# Altium project Sayma_AMC.PrjPcb (part 7 of 18)

## Sheet PWR_0V9_20A.SchDoc: Sayma AMC
size 420 x 297 mm; $$Internal___BlkDate: 0:12:25_2-9-18; $$Internal_NAME_PLACEHOLDER: a3sheet; $$Internal_Resolution: 00001mm; $$NotCommonProperty_@NAME: PWR_0V9_20A; $$NotCommonProperty_@PRINTORDER: 3; $$NotCommonProperty_@SHEET: 1; $$NotCommonProperty_@SHEETTOTAL: 1; CmpIndex: 76; Drawing Author: G.Kasprowicz; Drawing Number: Sayma AMC; Drawing Project: AMC FMC Carrier Board; Drawing Revision: 2.0; SymIndex: 2141; CheckedBy: P.Kulik,T.Przywozki,W.Ruclo; Author: G.Kasprowicz; CompanyName: WUT ISE; DrawnBy: G.Kasprowicz; Organization: WUT ISE; Address1: PW ISE; Address2: Nowowiejska 15/19 00-665 Warsaw; Address3: gkasprow@gmail.com; DocumentNumber: 13; Revision: 2; SheetNumber: 13; SheetTotal: 32; ModifiedBy: -; CheckedDate: -; Title2: VCCINT 0.95V; DivGrp: WUT ISE; Designer: G.Kasprowicz; ModifiedDate: -; ProjectName: Sensor Box
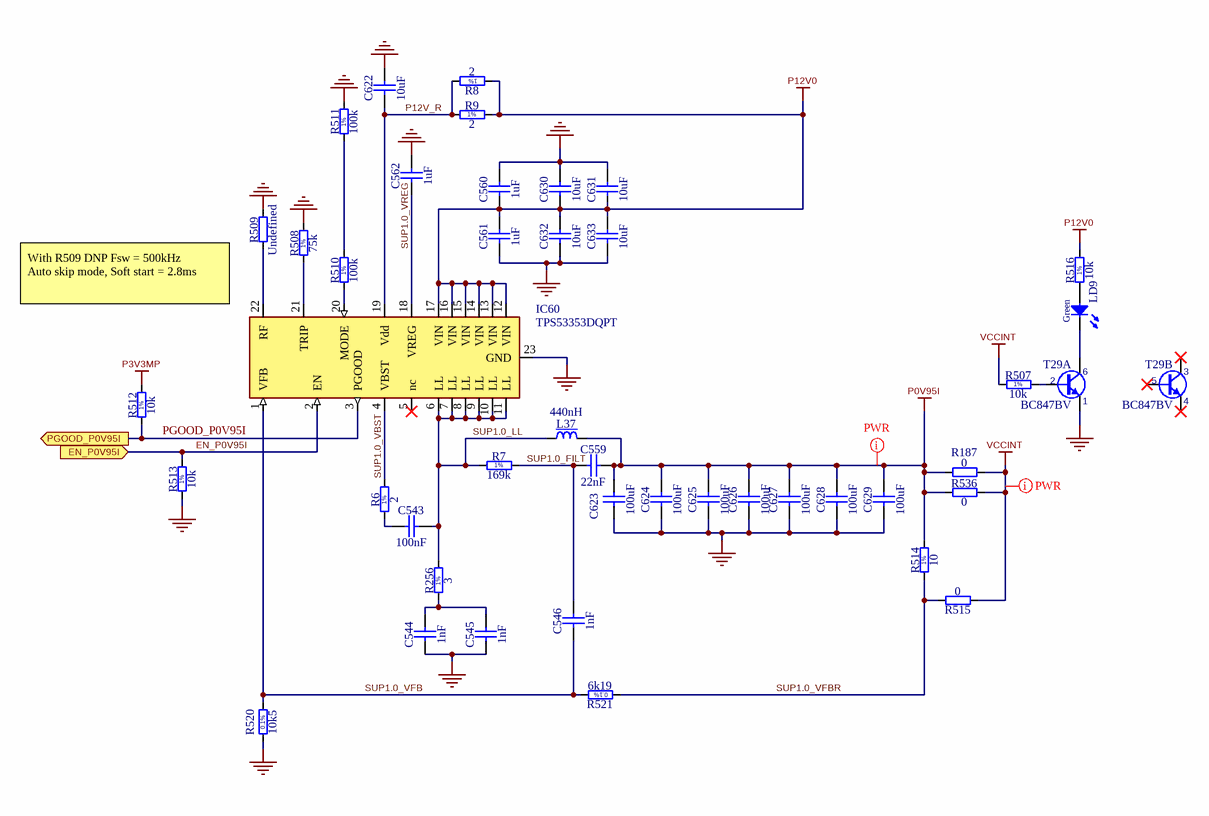
[diagram p10: PWR_0V9_20A.SchDoc]

### Parts
C543  100nF  [CAPC1005X55N]
C544  1nF  [CAPC1005X55N]
C545  1nF  [CAPC1005X55N]
C546  1nF  [CAPC1005X55N]
C559  22nF  [CAPC1608X87N]
C560  1uF  [CAPC1608X87N]
C561  1uF  [CAPC1608X87N]
C562  1uF  [CAPC1608X87N]
C622  10uF  [CAPC3216X180N]
C623  100uF  [CAPC3216X180N]
C624  100uF  [CAPC3216X180N]
C625  100uF  [CAPC3216X180N]
C626  100uF  [CAPC3216X180N]
C627  100uF  [CAPC3216X180N]
C628  100uF  [CAPC3216X180N]
C629  100uF  [CAPC3216X180N]
C630  10uF  [CAPC3216X180N]
C631  10uF  [CAPC3216X180N]
C632  10uF  [CAPC3216X180N]
C633  10uF  [CAPC3216X180N]
IC60  TPS53353DQPT  [LCCS50P600X500X150-22N]
L37  440nH  [IND_PULSE_PA0513]
LD9  Green  [LED_KINGBRIGHT_KPH-1608CGCK]
R6  2  [RESC1608X55N]
R7  169k  [RESC1608X55N]
R8  2  [RESC1608X55N]
R9  2  [RESC1608X55N]
R187  0  [RESC6331X70N]
R256  3  [RESC3216X65N]
R507  10k  [RESC1005X40N]
R508  75k  [RESC1005X40N]
R509  Undefined  [RESC1005X40N]
R510  100k  [RESC1005X40N]
R511  100k  [RESC1005X40N]
R512  10k  [RESC1005X40N]
R513  10k  [RESC1005X40N]
R514  10  [RESC1005X40N]
R515  0  [RESC1005X40N]
R516  10k  [RESC1005X40N]
R520  10k5  [RESC1608X55N]
R521  6k19  [RESC1608X55N]
R536  0  [RESC6331X70N]
T29  BC847BV  [SOTFL50P160X60-6N]  (parts A,B of 2)

### Ports
EN_P0V95I (in), PGOOD_P0V95I (out)

### Nets
GND: C544.1 C545.1 C560.2 C561.1 C562.2 C622.2 C623.1 C624.1 C625.1 C626.1 C627.1 C628.1 C629.1 C630.2 C631.2 C632.1 C633.1 IC60.23(GND) R508.2 R509.2 R511.2 R513.1 R520.1 T29.1(E)
P0V95I: C559.2 C623.2 C624.2 C625.2 C626.2 C627.2 C628.2 C629.2 L37.2 R187.1 R514.2 R536.1
P3V3MP: R512.2
P12V0: C560.1 C561.2 C630.1 C631.1 C632.2 C633.2 IC60.12(VIN) IC60.13(VIN) IC60.14(VIN) IC60.15(VIN) IC60.16(VIN) IC60.17(VIN) R8.2 R9.2 R516.2
VCCINT: R187.2 R507.1 R515.1 R536.2
EN_P0V95I: IC60.2(EN) R513.2 ; port EN_P0V95I  [project net EN_VCCINT]
P12V_R: C622.1 IC60.19(Vdd) R8.1 R9.1
PGOOD_P0V95I: IC60.3(PGOOD) R512.1 ; port PGOOD_P0V95I  [project net P0V95I_PG]
SUP1.0_FILT: C546.2 C559.1 R7.2
SUP1.0_LL: C543.2 IC60.6(LL) IC60.7(LL) IC60.8(LL) IC60.9(LL) IC60.10(LL) IC60.11(LL) L37.1 R7.1 R256.2
SUP1.0_VBST: IC60.4(VBST) R6.2
SUP1.0_VFB: C546.1 IC60.1(VFB) R520.2 R521.2
SUP1.0_VFBR: R514.1 R515.2 R521.1
SUP1.0_VREG: C562.1 IC60.18(VREG)
NetC543_1: C543.1 R6.1
NetC544_2: C544.2 C545.2 R256.1
NetIC60_20: IC60.20(MODE) R510.1
NetIC60_21: IC60.21(TRIP) R508.1
NetIC60_22: IC60.22(RF) R509.1
NetLD9_1: LD9.1(C) T29.6(C)
NetLD9_2: LD9.2(A) R516.1
NetR507_2: R507.2 T29.2(B)
NetR510_2: R510.2 R511.1

Not connected (* = marked no-connect by the designer): IC60 5(nc)*; T29 3(C)* 4(E)* 5(B)*

### Layout directives
net class PWR: P0V95I, VCCINT

### Notes on the sheet
- With R509 DNP Fsw = 500kHz
  Auto skip mode, Soft start = 2.8ms
- Project/Equipment
- Document
- Designer
- Drawn by
- Check.by
- Copyright WUT ISE 2018.
  This documentation describes Open Hardware and is licensed under the CERN OHL v.1.1. You may redistribute and modify this documentation under the terms of the CERN OHL v.1.1. (http://ohwr.org/CERNOHL). This documentation is distributed WITHOUT ANY EXPRESS OR IMPLIED WARRANTY, INCLUDING OF MERCHANTABILITY, SATISFACTORY QUALITY AND FITNESS FOR A PARTICULAR PURPOSE. Please see the CERN OHL v.1.1 for applicable conditions.
- Contact
- File
- Last Mod.
- Print Date
- Sheet
- Size
- A3
- of
- Rev
- (in symbol R0402_10K_1%_0.0625W_100PPM) 1%
- (in symbol R0402_10R_1%_0.0625W_200PPM) 1%
- (in symbol R0402_75K_1%_0.0625W_100PPM) 1%
- (in symbol R0402_100K_1%_0.0625W_100PPM) 1%
- (in symbol R0603_2R_1%_0.1W_200PPM) 1%
- (in symbol R0603_6K19_0.1%_0.063W_10PPM) 0.1%
- (in symbol R0603_10K5_0.1%_0.063W_10PPM) 0.1%
- (in symbol R0603_169K_1%_0.1W_100PPM) 1%
- (in symbol R1206_3R_1%_0.25W_200PPM) 1%

### Library data of the parts
C543 = CC0402_100NF_16V_10%_X5R: Non-polarised capacitor; Manufacturer: GENERIC; Part Description: SMD Multilayer Chip Ceramic Capacitor; Manufacturer1 Part Number: GRM155R61C104KA88D; Tolerance: ±10%; Voltage: 16V; TC: X5R; Manufacturer Part Number: CC0402_100NF_16V_10%_X5R; Part Number: CC0402_100NF_16V_10%_X5R; Value: 100nF; Component Kind: Standard; Component Type: Standard; Pin Count: 2; Status: None; Case: 0402; Mounted: Yes; Socket: No; SMD: Yes; Sense: No; Manufacturer1 Example: MURATA; Manufacturer1 ComponentHeight: 0.55mm; HelpURL: \\cern.ch\dfs\Applications\Altium\Datasheets\CC0402_X5R_MURATA_GRM.pdf; Author: CERN DEM JLC; CreateDate: 10.12.2013; LatestRevisionDate: 10.12.2013
C544-C546 = CC0402_1NF_50V_10%_X7R: Non-polarised capacitor; Manufacturer: GENERIC; Part Description: SMD Multilayer Chip Ceramic Capacitor; Manufacturer1 Part Number: 223858715623; Tolerance: ±10%; Voltage: 50V; TC: X7R; Manufacturer Part Number: CC0402_1NF_50V_10%_X7R; Part Number: CC0402_1NF_50V_10%_X7R; Value: 1nF; Component Kind: Standard; Component Type: Standard; Pin Count: 2; Status: Not Recommended; Case: 0402; Mounted: Yes; Socket: No; SMD: Yes; Sense: No; Manufacturer1 Example: PHYCOMP; Manufacturer1 ComponentHeight: 0.55mm; HelpURL: \\cern.ch\dfs\Applications\Altium\Datasheets\CC0402_X7R_PHYCOMP.pdf; Author: CERN DEM JLC; CreateDate: 03.12.2007; LatestRevisionDate: 03.12.2007
C559 = CC0603_22NF_50V_10%_X7R: Non-polarised capacitor; Manufacturer: GENERIC; Part Description: SMD Multilayer Chip Ceramic Capacitor; Manufacturer1 Part Number: 223858615641; Tolerance: ±10%; Voltage: 50V; TC: X7R; Manufacturer Part Number: CC0603_22NF_50V_10%_X7R; Part Number: CC0603_22NF_50V_10%_X7R; Value: 22nF; Component Kind: Standard; Component Type: Standard; Pin Count: 2; Status: Preferred; Case: 0603; Mounted: Yes; Socket: No; SMD: Yes; Sense: No; Manufacturer1 Example: PHYCOMP; Manufacturer1 ComponentHeight: 0.87mm; HelpURL: \\cern.ch\dfs\Applications\Altium\Datasheets\CC0603_X7R_PHYCOMP.pdf; Author: CERN DEM JLC; CreateDate: 03.12.2007; LatestRevisionDate: 03.12.2007
C560-C562 = CC0603_1UF_25V_10%_X7R: Non-polarised capacitor; Manufacturer: GENERIC; Part Description: SMD Multilayer Chip Ceramic Capacitor; Manufacturer1 Part Number: GRM188R71E105KA12D; Tolerance: ±10%; Voltage: 25V; TC: X7R; Manufacturer Part Number: CC0603_1UF_25V_10%_X7R; Part Number: CC0603_1UF_25V_10%_X7R; Value: 1uF; Component Kind: Standard; Component Type: Standard; Pin Count: 2; Status: None; Case: 0603; Mounted: Yes; Socket: No; SMD: Yes; Sense: No; Manufacturer1 Example: MURATA; Manufacturer1 ComponentHeight: 0.9mm; HelpURL: \\cern.ch\dfs\Applications\Altium\Datasheets\CC0603_X7R_MURATA.pdf; Author: CERN DEM JLC; CreateDate: 18.01.2011; LatestRevisionDate: 18.01.2011
C622 C630-C633 = CC1206_10uF_25V_10%_X7R: Non-polarised capacitor; Manufacturer: GENERIC; Part Description: SMD Multilayer Chip Ceramic Capacitor; Manufacturer1 Part Number: C1206C106K4RACTU; Tolerance: ±10%; Voltage: 25V; TC: X7R; Manufacturer Part Number: CC1206_10uF_25V_10%_X7R; Part Number: CC1206_10UF_25V_10%_X7R; Value: 10uF; Component Kind: Standard; Component Type: Standard; Pin Count: 2; Status: Preferred; Case: 1206; Mounted: Yes; Socket: No; SMD: Yes; Sense: No; Manufacturer1 Example: KEMET; Manufacturer1 ComponentHeight: 1.8mm; HelpURL: \\cern.ch\dfs\Applications\Altium\Datasheets\CC1206_X7R_KEMET.pdf; Author: CERN DEM JLC; CreateDate: 12.09.2012; LatestRevisionDate: 12.09.2012
C623-C629 = CC1206_100UF_6.3V_20%_X5R: Non-polarised capacitor; Manufacturer: GENERIC; Part Description: SMD Multilayer Chip Ceramic Capacitor; Manufacturer1 Part Number: C1206C107M9PACTU; Tolerance: ±10%; Voltage: 6.3V; TC: X5R; Manufacturer Part Number: CC1206_100UF_6.3V_20%_X5R; Part Number: CC1206_100UF_6.3V_20%_X5R; Value: 100uF; Component Kind: Standard; Component Type: Standard; Pin Count: 2; Status: None; Case: 1206; Mounted: Yes; Socket: No; SMD: Yes; Sense: No; Manufacturer1 Example: KEMET; Manufacturer1 ComponentHeight: 1.8mm; HelpURL: \\cern.ch\dfs\Applications\Altium\Datasheets\CC1206_X5R_KEMET.pdf; Author: CERN DEM JLC; CreateDate: 26.09.2012; LatestRevisionDate: 26.09.2012
IC60 = PM_TPS53353: High-Efficiency 20-A Synchronous Buck Converter with Eco-mode™; Supplier 1: Digi-Key; Supplier Part Number 1: 296-29490-1-ND; Manufacturer Part Number: TPS53353DQPT
L37 = IND_440NH_20%_PULSE_PA0513.441NLT: Inductor With Core; Manufacturer: PULSE ELECTRONICS; Part Description: SMT Power Inductor; Tolerance: ±20%; Power: 30A; Resistance: 0.0032R; Manufacturer Part Number: PA0513.441NLT; Part Number: IND_440NH_20%_PULSE_PA0513.441NLT; Value: 440nH; Component Kind: Standard; Component Type: Standard; Pin Count: 2; Status: None; Mounted: Yes; Socket: No; SMD: Yes; Sense: No; ComponentHeight: 8mm; HelpURL: \\cern.ch\dfs\Applications\Altium\Datasheets\IND_PULSE_PA0513.441NLT.pdf; Author: CERN DEM JLC; CreateDate: 15.11.2016; LatestRevisionDate: 15.11.2016
LD9 = LED_KINGBRIGHT_KPH-1608CGCK: LED Green 1C 2A; Part Description: SMD Green LED, Case 1.6mmX0.8mm(0603), 0.65mm Thickness; PressFit: No; Bonding: No; Manufacturer Part Number: KPH-1608CGCK; Manufacturer: KINGBRIGHT; PackageDescription: SMT Green LED, Case 0603, Body L 1.6 x W 0.8mm H 0.65mm; Part Number: LED_KINGBRIGHT_KPH-1608CGCK; Component Kind: Standard; Component Type: Standard; Color: Green; Pin Count: 2; Mounted: Yes; Socket: No; SMD: Yes; Sense: No; ComponentHeight: 0.65mm; HelpURL: \\cern.ch\dfs\Applications\Altium\Datasheets\LED_KINGBRIGHT_KPH-1608CGCK.pdf; Author: CERN DEM JLC; CreateDate: 03.07.2017; LatestRevisionDate: 03.07.2017
R6 R8 R9 = R0603_2R_1%_0.1W_200PPM: Resistor - 1%; Manufacturer: GENERIC; Part Description: General Purpose Thick Film Chip Resistor; Manufacturer1 Part Number: 232270462008L or RC0603FR-072RL; Power: 0.1W; TC: ±200ppm/°C; PressFit: No; Manufacturer Part Number: R0603_2R_1%_0.1W_200PPM; Part Number: R0603_2R_1%_0.1W_200PPM; Tolerance: ±1%; Value: 2; Component Kind: Standard; Component Type: Standard; Pin Count: 2; Status: Preferred; Case: 0603; Mounted: Yes; Sense: No; Socket: No; SMD: Yes; Manufacturer1 Example: YAGEO PHYCOMP; Manufacturer1 ComponentHeight: 0.65mm; HelpURL: \\cern.ch\dfs\Applications\Altium\Datasheets\R0603_Tyco_RN73.pdf; Author: CERN DEM JLC; CreateDate: 03.12.2007; LatestRevisionDate: 17.10.2012
R7 = R0603_169K_1%_0.1W_100PPM: Resistor - 1%; Manufacturer: GENERIC; Part Description: General Purpose Thick Film Chip Resistor; Manufacturer1 Part Number: CRCW0603169KFKEA; Power: 0.1W; TC: ±100ppm/°C; PressFit: No; Manufacturer Part Number: R0603_169K_1%_0.1W_100PPM; Part Number: R0603_169k_1%_0.1W_100PPM; Tolerance: ±1%; Value: 169k; Component Kind: Standard; Component Type: Standard; Pin Count: 2; Status: Preferred; Case: 0603; Mounted: Yes; Sense: No; Socket: No; SMD: Yes; Manufacturer1 Example: VISHAY; Manufacturer1 ComponentHeight: 0.50mm; HelpURL: \\cern.ch\dfs\Applications\Altium\Datasheets\R0603_VISHAY_CRCW e3.pdf; Author: CERN DEM JLC; CreateDate: 17.03.2014; LatestRevisionDate: 17.03.2014
R187 R536 = R2512_0R_JUMPER: Resistor; Manufacturer: GENERIC; Part Description: 16A (0.005R Max DC Resistance) Zero Ohm Jumper; Manufacturer1 Part Number: CRCW25120000Z0EG; PressFit: No; Manufacturer Part Number: R2512_0R_JUMPER; Part Number: R2512_0R_JUMPER; Value: 0; Component Kind: Standard; Component Type: Standard; Pin Count: 2; Status: Preferred; Case: 2512; Mounted: Yes; Sense: No; Socket: No; SMD: Yes; Manufacturer1 Example: VISHAY DRALORIC; Manufacturer1 ComponentHeight: 0.7mm; HelpURL: \\cern.ch\dfs\Applications\Altium\Datasheets\R2512_VISHAY_CRCW-HP E3.pdf; Author: CERN DEM JLC; CreateDate: 17.09.2014; LatestRevisionDate: 17.09.2014
R256 = R1206_3R_1%_0.25W_200PPM: Resistor - 1%; Manufacturer: GENERIC; Part Description: General Purpose Thick Film Chip Resistor; Manufacturer1 Part Number: 232272463008; Power: 0.25W; TC: ±200ppm/°C; PressFit: No; Manufacturer Part Number: R1206_3R_1%_0.25W_200PPM; Part Number: R1206_3R_1%_0.25W_200PPM; Tolerance: ±1%; Value: 3; Component Kind: Standard; Component Type: Standard; Pin Count: 2; Status: Preferred; Case: 1206; Mounted: Yes; Sense: No; Socket: No; SMD: Yes; Manufacturer1 Example: PHYCOMP; Manufacturer1 ComponentHeight: 0.65mm; HelpURL: \\cern.ch\dfs\Applications\Altium\Datasheets\R1206_Phycomp_RC1206.pdf; Author: CERN DEM JLC; CreateDate: 03.12.2007; LatestRevisionDate: 24.06.2009
R507 R512 R513 R516 = R0402_10K_1%_0.0625W_100PPM: Resistor - 1%; Manufacturer: GENERIC; Part Description: General Purpose Thick Film Chip Resistor; Manufacturer1 Part Number: 232270671003L; TC: ±100ppm/°C; PressFit: No; Manufacturer Part Number: R0402_10K_1%_0.0625W_100PPM; Part Number: R0402_10K_1%_0.0625W_100PPM; Tolerance: ±1%; Value: 10k; Component Kind: Standard; Component Type: Standard; Pin Count: 2; Status: Not Recommended; Power: 0.0625W; Case: 0402; Mounted: Yes; Sense: No; Socket: No; SMD: Yes; Manufacturer1 Example: YAGEO PHYCOMP; Manufacturer1 ComponentHeight: 0.4mm; HelpURL: \\cern.ch\dfs\Applications\Altium\Datasheets\R0402_Phycomp_RC0402.pdf; Author: CERN DEM JLC; CreateDate: 03.12.2007; LatestRevisionDate: 17.10.2012
R508 = R0402_75K_1%_0.0625W_100PPM: Resistor - 1%; Manufacturer: GENERIC; Part Description: General Purpose Thick Film Chip Resistor; Manufacturer1 Part Number: 232270677503L; TC: ±100ppm/°C; PressFit: No; Manufacturer Part Number: R0402_75K_1%_0.0625W_100PPM; Part Number: R0402_75K_1%_0.0625W_100PPM; Tolerance: ±1%; Value: 75k; Component Kind: Standard; Component Type: Standard; Pin Count: 2; Status: Not Recommended; Power: 0.0625W; Case: 0402; Mounted: Yes; Sense: No; Socket: No; SMD: Yes; Manufacturer1 Example: YAGEO PHYCOMP; Manufacturer1 ComponentHeight: 0.4mm; HelpURL: \\cern.ch\dfs\Applications\Altium\Datasheets\R0402_Phycomp_RC0402.pdf; Author: CERN DEM JLC; CreateDate: 03.12.2007; LatestRevisionDate: 17.10.2012
R509 = R0402_NO-VALUE: Resistor; Part Description: Reserved Footprint For a 0402 (1005) Chip Resistor; PressFit: No; Mounted: No; Manufacturer Part Number: R0402_NO-VALUE; Manufacturer: Undefined; Part Number: R0402_NO-VALUE; Value: Undefined; Component Kind: Standard; Component Type: Standard; Pin Count: 2; Status: None; Case: 0402; Sense: No; Socket: No; SMD: Yes; Manufacturer1 Example: Undefined; Manufacturer1 Part Number: Undefined; Manufacturer1 ComponentHeight: Undefined; HelpURL: Undefined; Author: CERN DEM JLC; CreateDate: 03.12.2007; LatestRevisionDate: 13.03.2008
R510 R511 = R0402_100K_1%_0.0625W_100PPM: Resistor - 1%; Manufacturer: GENERIC; Part Description: General Purpose Thick Film Chip Resistor; Manufacturer1 Part Number: 232270671004L; TC: ±100ppm/°C; PressFit: No; Manufacturer Part Number: R0402_100K_1%_0.0625W_100PPM; Part Number: R0402_100K_1%_0.0625W_100PPM; Tolerance: ±1%; Value: 100k; Component Kind: Standard; Component Type: Standard; Pin Count: 2; Status: Not Recommended; Power: 0.0625W; Case: 0402; Mounted: Yes; Sense: No; Socket: No; SMD: Yes; Manufacturer1 Example: YAGEO PHYCOMP; Manufacturer1 ComponentHeight: 0.4mm; HelpURL: \\cern.ch\dfs\Applications\Altium\Datasheets\R0402_Phycomp_RC0402.pdf; Author: CERN DEM JLC; CreateDate: 03.12.2007; LatestRevisionDate: 17.10.2012
R514 = R0402_10R_1%_0.0625W_200PPM: Resistor - 1%; Manufacturer: GENERIC; Part Description: General Purpose Thick Film Chip Resistor; Manufacturer1 Part Number: 232270671009L; TC: ±200ppm/°C; PressFit: No; Manufacturer Part Number: R0402_10R_1%_0.0625W_200PPM; Part Number: R0402_10R_1%_0.0625W_200PPM; Tolerance: ±1%; Value: 10; Component Kind: Standard; Component Type: Standard; Pin Count: 2; Status: Not Recommended; Power: 0.0625W; Case: 0402; Mounted: Yes; Sense: No; Socket: No; SMD: Yes; Manufacturer1 Example: YAGEO PHYCOMP; Manufacturer1 ComponentHeight: 0.4mm; HelpURL: \\cern.ch\dfs\Applications\Altium\Datasheets\R0402_Phycomp_RC0402.pdf; Author: CERN DEM JLC; CreateDate: 24.06.2009; LatestRevisionDate: 17.10.2012
R515 = R0402_0R_JUMPER: Resistor; Manufacturer: GENERIC; Part Description: 1A (0.05R Max DC Resistance) Zero Ohm Jumper; Manufacturer1 Part Number: 232270591001L; PressFit: No; Manufacturer Part Number: R0402_0R_JUMPER; Part Number: R0402_0R_JUMPER; Value: 0; Component Kind: Standard; Component Type: Standard; Pin Count: 2; Status: Not Recommended; Case: 0402; Mounted: Yes; Sense: No; Socket: No; SMD: Yes; Manufacturer1 Example: YAGEO PHYCOMP; Manufacturer1 ComponentHeight: 0.4mm; HelpURL: \\cern.ch\dfs\Applications\Altium\Datasheets\R0402_Phycomp_RC0402.pdf; Author: CERN DEM JLC; CreateDate: 03.12.2007; LatestRevisionDate: 17.10.2012
R520 = R0603_10K5_0.1%_0.063W_10PPM: Resistor - 0.1%; Manufacturer: GENERIC; Part Description: Thin Film Chip Resistor; Manufacturer1 Part Number: RN73C1J10K5BTDF; Power: 0.063W; TC: ±10ppm; PressFit: No; Manufacturer Part Number: R0603_10K5_0.1%_0.063W_10PPM; Part Number: R0603_10K5_0.1%_0.063W_10PPM; Tolerance: ±0.1%; Value: 10k5; Component Kind: Standard; Component Type: Standard; Pin Count: 2; Status: Not Recommended; Case: 0603; Mounted: Yes; Sense: No; Socket: No; SMD: Yes; Manufacturer1 Example: TYCO HOLSWORTHY; Manufacturer1 ComponentHeight: 0.5mm; HelpURL: \\cern.ch\dfs\Applications\Altium\Datasheets\R0603_Tyco_RN73.pdf; Author: CERN DEM JLC; CreateDate: 03.12.2007; LatestRevisionDate: 13.03.2008
R521 = R0603_6K19_0.1%_0.063W_10PPM: Resistor - 0.1%; Manufacturer: GENERIC; Part Description: Thin Film Chip Resistor; Manufacturer1 Part Number: RN73C1J6K19BTDF; Power: 0.063W; TC: ±10ppm; PressFit: No; Manufacturer Part Number: R0603_6K19_0.1%_0.063W_10PPM; Part Number: R0603_6K19_0.1%_0.063W_10PPM; Tolerance: ±0.1%; Value: 6k19; Component Kind: Standard; Component Type: Standard; Pin Count: 2; Status: Not Recommended; Case: 0603; Mounted: Yes; Sense: No; Socket: No; SMD: Yes; Manufacturer1 Example: TYCO HOLSWORTHY; Manufacturer1 ComponentHeight: 0.5mm; HelpURL: \\cern.ch\dfs\Applications\Altium\Datasheets\R0603_Tyco_RN73.pdf; Author: CERN DEM JLC; CreateDate: 03.12.2007; LatestRevisionDate: 13.03.2008
T29 = BC847BV: 45V, 100mA NPN General Purpose Double Transistor; Manufacturer: NXP SEMICONDUCTORS; Part Description: 45V 100mA NPN General Purpose Double Transistor; PressFit: No; Bonding: No; Manufacturer Part Number: BC847BV; PackageDescription: SOTFL (SOT666), 0.50mm, Pitch; 6 Pin, 1.20mm W X 1.60mm L X 0.60mm H Body, IPC Medium Density; Part Number: BC847BV; Component Kind: Standard; Component Type: Standard; Device: BC847BV; Pin Count: 6; Case: SOT666; Mounted: Yes; Socket: No; SMD: Yes; Sense: No; ComponentHeight: 0.6mm; HelpURL: \\cern.ch\dfs\Applications\Altium\Datasheets\BC847BV.pdf; Author: CERN DEM JLC; CreateDate: 01.12.2011; LatestRevisionDate: 01.12.2011

## Sheet RTM_CON.SchDoc: Sayma AMC
size 420 x 297 mm; $$Internal___BlkDate: 0:12:25_2-9-18; $$Internal_NAME_PLACEHOLDER: a3sheet; $$Internal_Resolution: 00001mm; $$NotCommonProperty_@NAME: RTM_CON; $$NotCommonProperty_@PRINTORDER: 29; $$NotCommonProperty_@SHEET: 1; $$NotCommonProperty_@SHEETTOTAL: 30; CmpIndex: 74; Drawing Author: G.Kasprowicz; Drawing Number: Sayma AMC; Drawing Project: AMC FMC Carrier Board; Drawing Revision: 2.0; SymIndex: 2141; CheckedBy: P.Kulik,T.Przywozki,W.Ruclo; Author: G.Kasprowicz; CompanyName: WUT ISE; DrawnBy: G.Kasprowicz; Organization: WUT ISE; Address1: PW ISE; Address2: Nowowiejska 15/19 00-665 Warsaw; Address3: gkasprow@gmail.com; DocumentNumber: 3; Revision: 2; SheetNumber: 3; SheetTotal: 32; ModifiedBy: -; CheckedDate: -; Title2: RTM Connector; DivGrp: WUT ISE; Designer: G.Kasprowicz; ModifiedDate: -; ProjectName: Sensor Box
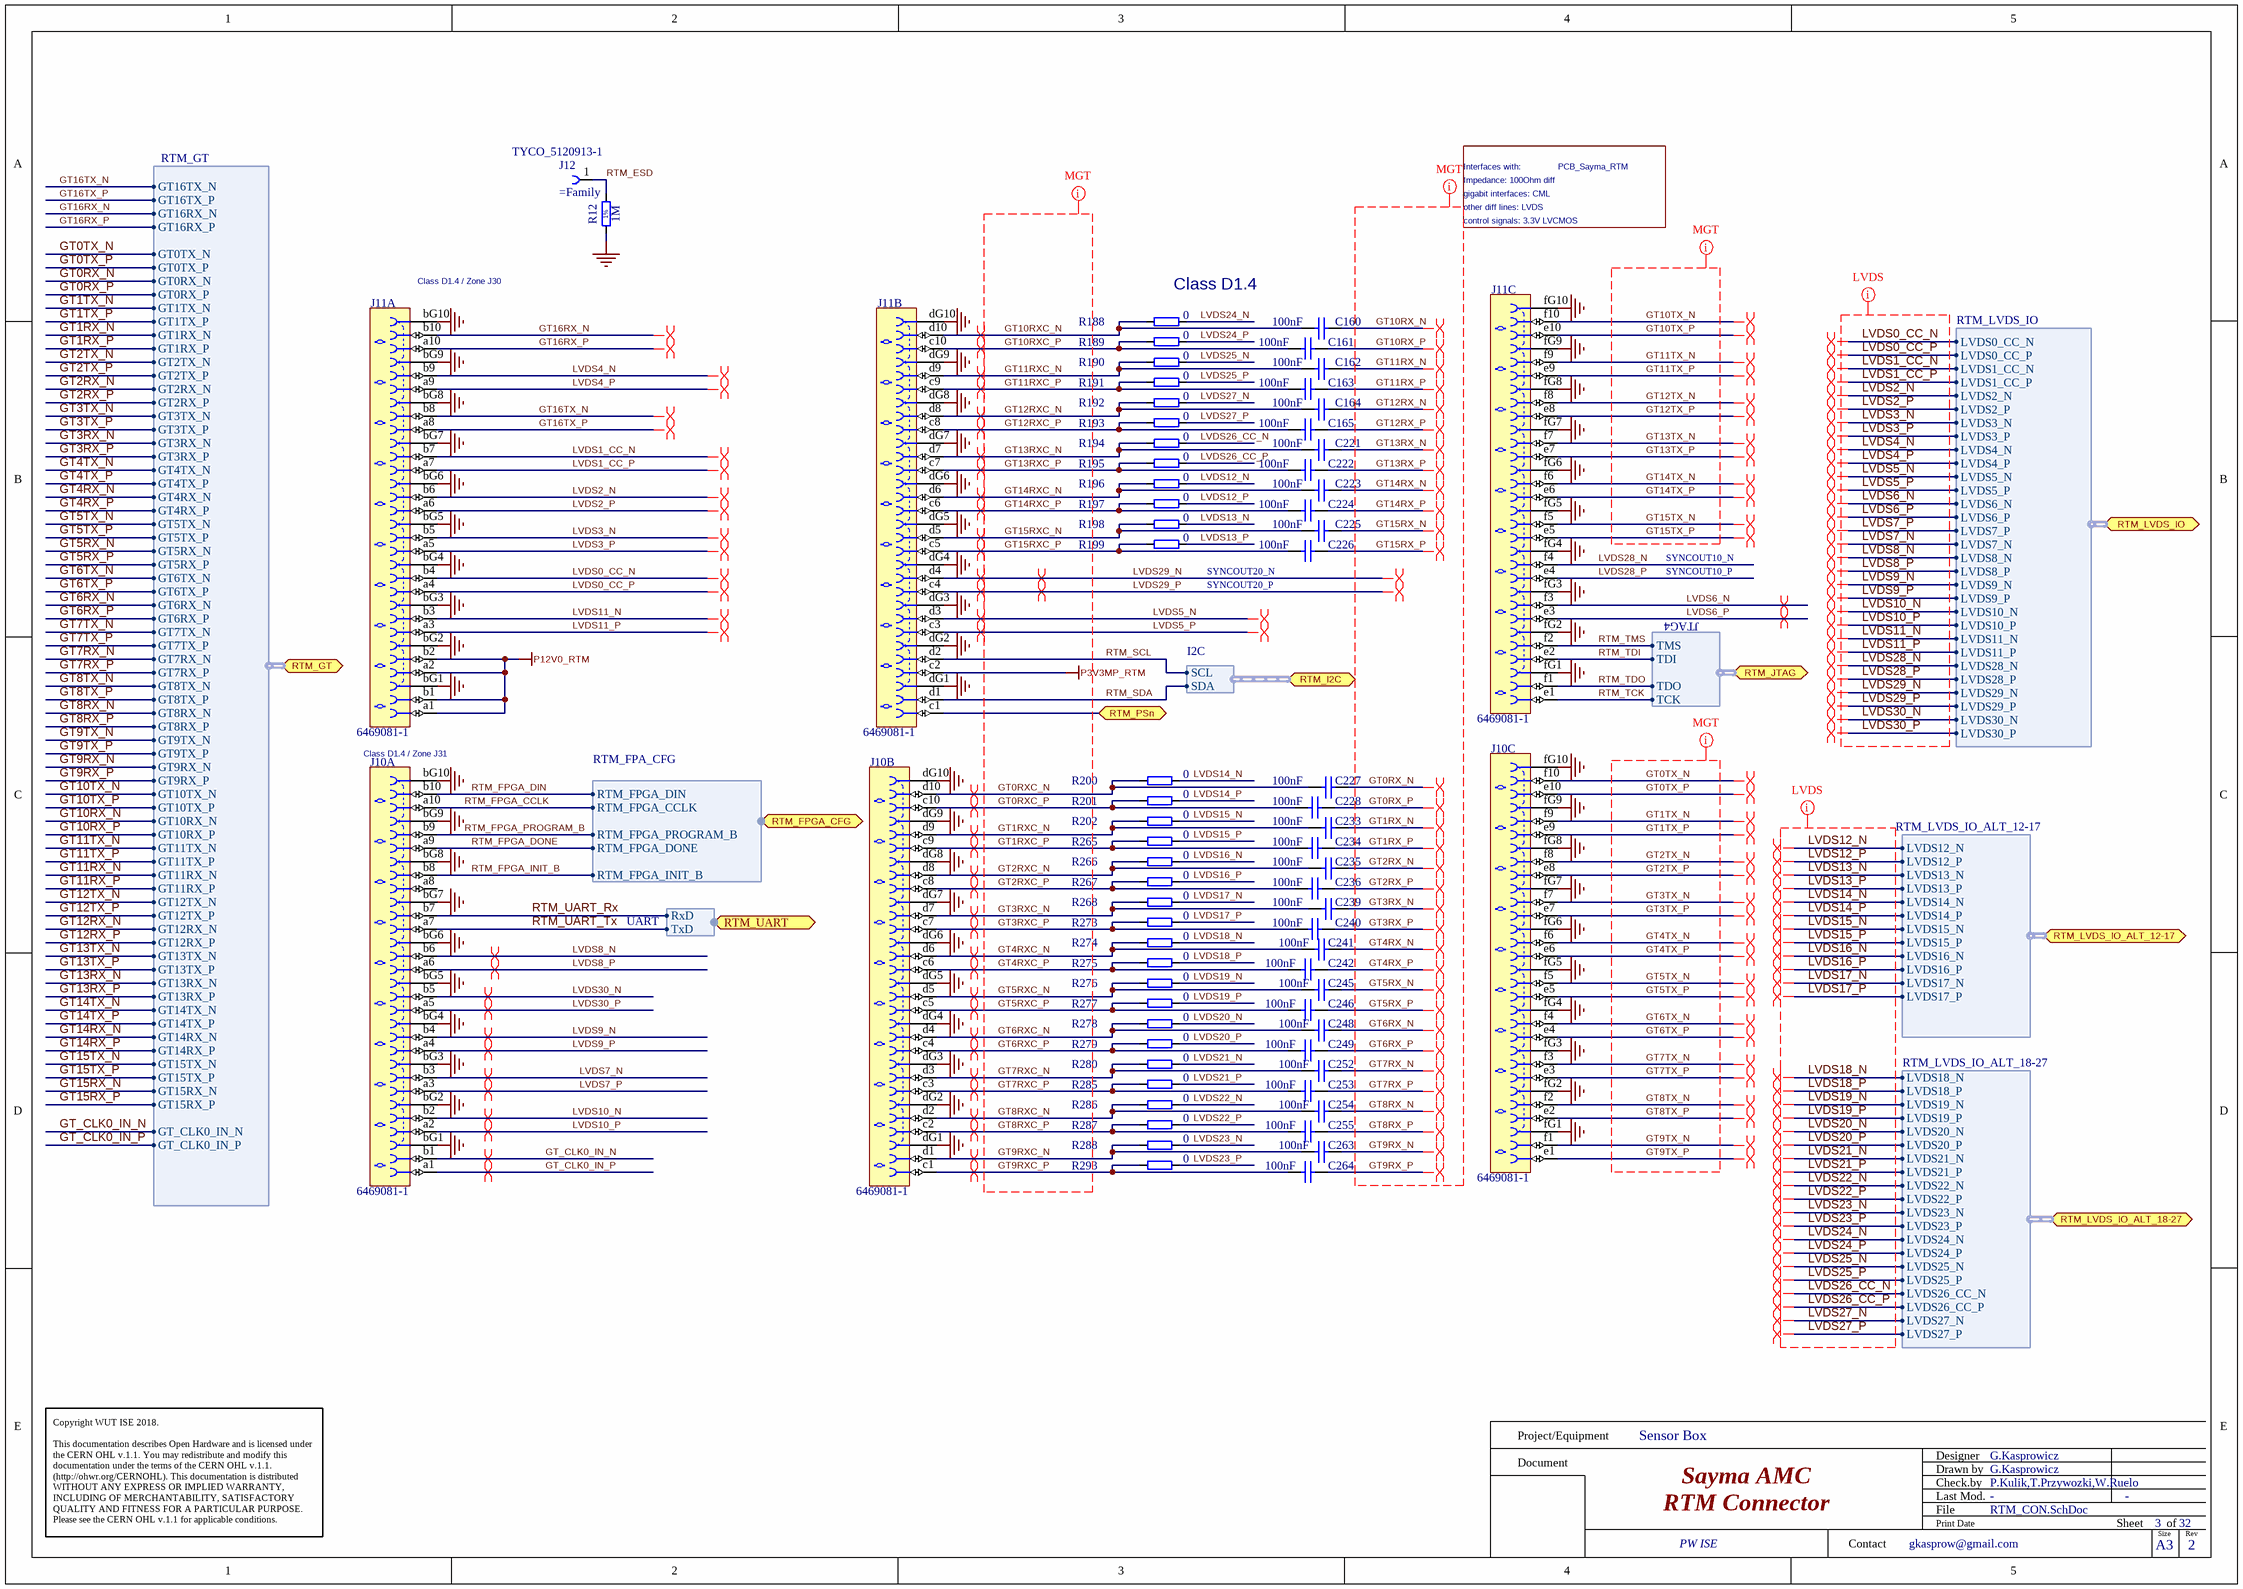
[diagram p11: RTM_CON.SchDoc]

### Parts
C160  100nF  [CAPC0603X33N]
C161  100nF  [CAPC0603X33N]
C162  100nF  [CAPC0603X33N]
C163  100nF  [CAPC0603X33N]
C164  100nF  [CAPC0603X33N]
C165  100nF  [CAPC0603X33N]
C221  100nF  [CAPC0603X33N]
C222  100nF  [CAPC0603X33N]
C223  100nF  [CAPC0603X33N]
C224  100nF  [CAPC0603X33N]
C225  100nF  [CAPC0603X33N]
C226  100nF  [CAPC0603X33N]
C227  100nF  [CAPC0603X33N]
C228  100nF  [CAPC0603X33N]
C233  100nF  [CAPC0603X33N]
C234  100nF  [CAPC0603X33N]
C235  100nF  [CAPC0603X33N]
C236  100nF  [CAPC0603X33N]
C239  100nF  [CAPC0603X33N]
C240  100nF  [CAPC0603X33N]
C241  100nF  [CAPC0603X33N]
C242  100nF  [CAPC0603X33N]
C245  100nF  [CAPC0603X33N]
C246  100nF  [CAPC0603X33N]
C248  100nF  [CAPC0603X33N]
C249  100nF  [CAPC0603X33N]
C252  100nF  [CAPC0603X33N]
C253  100nF  [CAPC0603X33N]
C254  100nF  [CAPC0603X33N]
C255  100nF  [CAPC0603X33N]
C263  100nF  [CAPC0603X33N]
C264  100nF  [CAPC0603X33N]
J10  Manufacturer Part Number: 6469081-1  [TYCO_6469081-1]  (hidden comment: Advanced TCA)  (parts A,B,C of 3)
J11  Manufacturer Part Number: 6469081-1  [TYCO_6469081-1]  (hidden comment: Advanced TCA)  (parts A,B,C of 3)
J12  (no value)  [TYCO_5120913-1]
R12  1M  [RESC5025X65N]
R188  0  [RESC0603X28N]
R189  0  [RESC0603X28N]
R190  0  [RESC0603X28N]
R191  0  [RESC0603X28N]
R192  0  [RESC0603X28N]
R193  0  [RESC0603X28N]
R194  0  [RESC0603X28N]
R195  0  [RESC0603X28N]
R196  0  [RESC0603X28N]
R197  0  [RESC0603X28N]
R198  0  [RESC0603X28N]
R199  0  [RESC0603X28N]
R200  0  [RESC0603X28N]
R201  0  [RESC0603X28N]
R202  0  [RESC0603X28N]
R265  0  [RESC0603X28N]
R266  0  [RESC0603X28N]
R267  0  [RESC0603X28N]
R268  0  [RESC0603X28N]
R273  0  [RESC0603X28N]
R274  0  [RESC0603X28N]
R275  0  [RESC0603X28N]
R276  0  [RESC0603X28N]
R277  0  [RESC0603X28N]
R278  0  [RESC0603X28N]
R279  0  [RESC0603X28N]
R280  0  [RESC0603X28N]
R285  0  [RESC0603X28N]
R286  0  [RESC0603X28N]
R287  0  [RESC0603X28N]
R288  0  [RESC0603X28N]
R293  0  [RESC0603X28N]

### Ports
RTM_FPGA_CFG (bidir, harness RTM_FPA_CFG), RTM_GT (bidir, harness RTM_GT), RTM_I2C (bidir, harness I2C), RTM_JTAG (bidir, harness JTAG4), RTM_LVDS_IO (bidir, harness RTM_LVDS_IO), RTM_LVDS_IO_ALT_12-17 (bidir, harness RTM_LVDS_IO_ALT_12-17), RTM_LVDS_IO_ALT_18-27 (bidir, harness RTM_LVDS_IO_ALT_18-27), RTM_PSn (bidir), RTM_UART (bidir, harness UART)

### Harnesses
JTAG4: TCK, TDI, TDO, TMS
I2C: SCL, SDA
RTM_FPA_CFG: RTM_FPGA_DIN, RTM_FPGA_CCLK, RTM_FPGA_PROGRAM_B, RTM_FPGA_DONE, RTM_FPGA_INIT_B
RTM_GT: GT0TX_N, GT0TX_P, GT0RX_N, GT0RX_P, GT1TX_N, GT1TX_P, GT1RX_N, GT1RX_P, GT2TX_N, GT2TX_P, GT2RX_N, GT2RX_P, GT3TX_N, GT3TX_P, GT3RX_N, GT3RX_P, GT4TX_N, GT4TX_P, GT4RX_N, GT4RX_P, GT5TX_N, GT5TX_P, GT5RX_N, GT5RX_P, GT6TX_N, GT6TX_P, GT6RX_N, GT6RX_P, GT7TX_N, GT7TX_P, GT7RX_N, GT7RX_P, GT8TX_N, GT8TX_P, GT8RX_N, GT8RX_P, GT9TX_N, GT9TX_P, GT9RX_N, GT9RX_P, GT10TX_N, GT10TX_P, GT10RX_N, GT10RX_P, GT11TX_N, GT11TX_P, GT11RX_N, GT11RX_P, GT12TX_N, GT12TX_P, GT12RX_N, GT12RX_P, GT13TX_N, GT13TX_P, GT13RX_N, GT13RX_P, GT14TX_N, GT14TX_P, GT14RX_N, GT14RX_P, GT15TX_N, GT15TX_P, GT15RX_N, GT15RX_P, GT_CLK0_IN_N, GT_CLK0_IN_P, GT16TX_N, GT16TX_P, GT16RX_N, GT16RX_P
RTM_LVDS_IO: LVDS0_CC_N, LVDS0_CC_P, LVDS1_CC_N, LVDS1_CC_P, LVDS2_N, LVDS2_P, LVDS3_N, LVDS3_P, LVDS4_N, LVDS4_P, LVDS5_N, LVDS5_P, LVDS6_N, LVDS6_P, LVDS7_P, LVDS7_N, LVDS8_N, LVDS8_P, LVDS9_N, LVDS9_P, LVDS10_N, LVDS10_P, LVDS11_N, LVDS11_P, LVDS28_N, LVDS28_P, LVDS29_N, LVDS29_P, LVDS30_N, LVDS30_P
RTM_LVDS_IO_ALT_18-27: LVDS19_N, LVDS19_P, LVDS20_N, LVDS20_P, LVDS21_N, LVDS21_P, LVDS22_N, LVDS22_P, LVDS23_N, LVDS23_P, LVDS24_N, LVDS24_P, LVDS25_N, LVDS25_P, LVDS26_CC_N, LVDS26_CC_P, LVDS27_N, LVDS27_P, LVDS18_N, LVDS18_P
RTM_LVDS_IO_ALT_12-17: LVDS12_N, LVDS12_P, LVDS13_N, LVDS13_P, LVDS14_N, LVDS14_P, LVDS15_N, LVDS15_P, LVDS16_N, LVDS16_P, LVDS17_N, LVDS17_P
UART: RxD, TxD

### Nets
GND: J10.bG1 J10.bG2 J10.bG3 J10.bG4 J10.bG5 J10.bG6 J10.bG7 J10.bG8 J10.bG9 J10.bG10 J10.dG1 J10.dG2 J10.dG3 J10.dG4 J10.dG5 J10.dG6 J10.dG7 J10.dG8 J10.dG9 J10.dG10 J10.fG1 J10.fG2 J10.fG3 J10.fG4 J10.fG5 J10.fG6 J10.fG7 J10.fG8 J10.fG9 J10.fG10 J11.bG1 J11.bG2 J11.bG3 J11.bG4 J11.bG5 J11.bG6 J11.bG7 J11.bG8 J11.bG9 J11.bG10 J11.dG1 J11.dG2 J11.dG3 J11.dG4 J11.dG5 J11.dG6 J11.dG7 J11.dG8 J11.dG9 J11.dG10 J11.fG1 J11.fG2 J11.fG3 J11.fG4 J11.fG5 J11.fG6 J11.fG7 J11.fG8 J11.fG9 J11.fG10 R12.1
P3V3MP_RTM: J11.c2
P12V0_RTM: J11.a1 J11.a2 J11.b1 J11.b2
GT0RX_N: C227.2 ; port RTM_GT.GT0RX_N
GT0RX_P: C228.2 ; port RTM_GT.GT0RX_P
GT0RXC_N: C227.1 J10.d10 R200.1
GT0RXC_P: C228.1 J10.c10 R201.1
GT0TX_N: J10.f10 ; port RTM_GT.GT0TX_N
GT0TX_P: J10.e10 ; port RTM_GT.GT0TX_P
GT1RX_N: C233.2 ; port RTM_GT.GT1RX_N
GT1RX_P: C234.2 ; port RTM_GT.GT1RX_P
GT1RXC_N: C233.1 J10.d9 R202.1
GT1RXC_P: C234.1 J10.c9 R265.1
GT1TX_N: J10.f9 ; port RTM_GT.GT1TX_N
GT1TX_P: J10.e9 ; port RTM_GT.GT1TX_P
GT2RX_N: C235.2 ; port RTM_GT.GT2RX_N
GT2RX_P: C236.2 ; port RTM_GT.GT2RX_P
GT2RXC_N: C235.1 J10.d8 R266.1
GT2RXC_P: C236.1 J10.c8 R267.1
GT2TX_N: J10.f8 ; port RTM_GT.GT2TX_N
GT2TX_P: J10.e8 ; port RTM_GT.GT2TX_P
GT3RX_N: C239.2 ; port RTM_GT.GT3RX_N
GT3RX_P: C240.2 ; port RTM_GT.GT3RX_P
GT3RXC_N: C239.1 J10.d7 R268.1
GT3RXC_P: C240.1 J10.c7 R273.1
GT3TX_N: J10.f7 ; port RTM_GT.GT3TX_N
GT3TX_P: J10.e7 ; port RTM_GT.GT3TX_P
GT4RX_N: C241.2 ; port RTM_GT.GT4RX_N
GT4RX_P: C242.2 ; port RTM_GT.GT4RX_P
GT4RXC_N: C241.1 J10.d6 R274.1
GT4RXC_P: C242.1 J10.c6 R275.1
GT4TX_N: J10.f6 ; port RTM_GT.GT4TX_N
GT4TX_P: J10.e6 ; port RTM_GT.GT4TX_P
GT5RX_N: C245.2 ; port RTM_GT.GT5RX_N
GT5RX_P: C246.2 ; port RTM_GT.GT5RX_P
GT5RXC_N: C245.1 J10.d5 R276.1
GT5RXC_P: C246.1 J10.c5 R277.1
GT5TX_N: J10.f5 ; port RTM_GT.GT5TX_N
GT5TX_P: J10.e5 ; port RTM_GT.GT5TX_P
GT6RX_N: C248.2 ; port RTM_GT.GT6RX_N
GT6RX_P: C249.2 ; port RTM_GT.GT6RX_P
GT6RXC_N: C248.1 J10.d4 R278.1
GT6RXC_P: C249.1 J10.c4 R279.1
GT6TX_N: J10.f4 ; port RTM_GT.GT6TX_N
GT6TX_P: J10.e4 ; port RTM_GT.GT6TX_P
GT7RX_N: C252.2 ; port RTM_GT.GT7RX_N
GT7RX_P: C253.2 ; port RTM_GT.GT7RX_P
GT7RXC_N: C252.1 J10.d3 R280.1
GT7RXC_P: C253.1 J10.c3 R285.1
GT7TX_N: J10.f3 ; port RTM_GT.GT7TX_N
GT7TX_P: J10.e3 ; port RTM_GT.GT7TX_P
GT8RX_N: C254.2 ; port RTM_GT.GT8RX_N
GT8RX_P: C255.2 ; port RTM_GT.GT8RX_P
GT8RXC_N: C254.1 J10.d2 R286.1
GT8RXC_P: C255.1 J10.c2 R287.1
GT8TX_N: J10.f2 ; port RTM_GT.GT8TX_N
GT8TX_P: J10.e2 ; port RTM_GT.GT8TX_P
GT9RX_N: C263.2 ; port RTM_GT.GT9RX_N
GT9RX_P: C264.2 ; port RTM_GT.GT9RX_P
GT9RXC_N: C263.1 J10.d1 R288.1
GT9RXC_P: C264.1 J10.c1 R293.1
GT9TX_N: J10.f1 ; port RTM_GT.GT9TX_N
GT9TX_P: J10.e1 ; port RTM_GT.GT9TX_P
GT10RX_N: C160.2 ; port RTM_GT.GT10RX_N
GT10RX_P: C161.2 ; port RTM_GT.GT10RX_P
GT10RXC_N: C160.1 J11.d10 R188.1
GT10RXC_P: C161.1 J11.c10 R189.1
GT10TX_N: J11.f10 ; port RTM_GT.GT10TX_N
GT10TX_P: J11.e10 ; port RTM_GT.GT10TX_P
GT11RX_N: C162.2 ; port RTM_GT.GT11RX_N
GT11RX_P: C163.2 ; port RTM_GT.GT11RX_P
GT11RXC_N: C162.1 J11.d9 R190.1
GT11RXC_P: C163.1 J11.c9 R191.1
GT11TX_N: J11.f9 ; port RTM_GT.GT11TX_N
GT11TX_P: J11.e9 ; port RTM_GT.GT11TX_P
GT12RX_N: C164.2 ; port RTM_GT.GT12RX_N
GT12RX_P: C165.2 ; port RTM_GT.GT12RX_P
GT12RXC_N: C164.1 J11.d8 R192.1
GT12RXC_P: C165.1 J11.c8 R193.1
GT12TX_N: J11.f8 ; port RTM_GT.GT12TX_N
GT12TX_P: J11.e8 ; port RTM_GT.GT12TX_P
GT13RX_N: C221.2 ; port RTM_GT.GT13RX_N
GT13RX_P: C222.2 ; port RTM_GT.GT13RX_P
GT13RXC_N: C221.1 J11.d7 R194.1
GT13RXC_P: C222.1 J11.c7 R195.1
GT13TX_N: J11.f7 ; port RTM_GT.GT13TX_N
GT13TX_P: J11.e7 ; port RTM_GT.GT13TX_P
GT14RX_N: C223.2 ; port RTM_GT.GT14RX_N
GT14RX_P: C224.2 ; port RTM_GT.GT14RX_P
GT14RXC_N: C223.1 J11.d6 R196.1
GT14RXC_P: C224.1 J11.c6 R197.1
GT14TX_N: J11.f6 ; port RTM_GT.GT14TX_N
GT14TX_P: J11.e6 ; port RTM_GT.GT14TX_P
GT15RX_N: C225.2 ; port RTM_GT.GT15RX_N
GT15RX_P: C226.2 ; port RTM_GT.GT15RX_P
GT15RXC_N: C225.1 J11.d5 R198.1
GT15RXC_P: C226.1 J11.c5 R199.1
GT15TX_N: J11.f5 ; port RTM_GT.GT15TX_N
GT15TX_P: J11.e5 ; port RTM_GT.GT15TX_P
GT16RX_N: J11.b10 ; port RTM_GT.GT16RX_N
GT16RX_P: J11.a10 ; port RTM_GT.GT16RX_P
GT16TX_N: J11.b8 ; port RTM_GT.GT16TX_N
GT16TX_P: J11.a8 ; port RTM_GT.GT16TX_P
GT_CLK0_IN_N: J10.b1 ; port RTM_GT.GT_CLK0_IN_N
GT_CLK0_IN_P: J10.a1 ; port RTM_GT.GT_CLK0_IN_P
LVDS0_CC_N: J11.b4 ; port RTM_LVDS_IO.LVDS0_CC_N
LVDS0_CC_P: J11.a4 ; port RTM_LVDS_IO.LVDS0_CC_P
LVDS1_CC_N: J11.b7 ; port RTM_LVDS_IO.LVDS1_CC_N
LVDS1_CC_P: J11.a7 ; port RTM_LVDS_IO.LVDS1_CC_P
LVDS2_N: J11.b6 ; port RTM_LVDS_IO.LVDS2_N
LVDS2_P: J11.a6 ; port RTM_LVDS_IO.LVDS2_P
LVDS3_N: J11.b5 ; port RTM_LVDS_IO.LVDS3_N
LVDS3_P: J11.a5 ; port RTM_LVDS_IO.LVDS3_P
LVDS4_N: J11.b9 ; port RTM_LVDS_IO.LVDS4_N
LVDS4_P: J11.a9 ; port RTM_LVDS_IO.LVDS4_P
LVDS5_N: J11.d3 ; port RTM_LVDS_IO.LVDS5_N
LVDS5_P: J11.c3 ; port RTM_LVDS_IO.LVDS5_P
LVDS6_N: J11.f3 ; port RTM_LVDS_IO.LVDS6_N
LVDS6_P: J11.e3 ; port RTM_LVDS_IO.LVDS6_P
LVDS7_N: J10.b3 ; port RTM_LVDS_IO.LVDS7_N
LVDS7_P: J10.a3 ; port RTM_LVDS_IO.LVDS7_P
LVDS8_N: J10.b6 ; port RTM_LVDS_IO.LVDS8_N
LVDS8_P: J10.a6 ; port RTM_LVDS_IO.LVDS8_P
LVDS9_N: J10.b4 ; port RTM_LVDS_IO.LVDS9_N
LVDS9_P: J10.a4 ; port RTM_LVDS_IO.LVDS9_P
LVDS10_N: J10.b2 ; port RTM_LVDS_IO.LVDS10_N
LVDS10_P: J10.a2 ; port RTM_LVDS_IO.LVDS10_P
LVDS11_N: J11.b3 ; port RTM_LVDS_IO.LVDS11_N
LVDS11_P: J11.a3 ; port RTM_LVDS_IO.LVDS11_P
LVDS12_N: R196.2 ; port RTM_LVDS_IO_ALT_12-17.LVDS12_N
LVDS12_P: R197.2 ; port RTM_LVDS_IO_ALT_12-17.LVDS12_P
LVDS13_N: R198.2 ; port RTM_LVDS_IO_ALT_12-17.LVDS13_N
LVDS13_P: R199.2 ; port RTM_LVDS_IO_ALT_12-17.LVDS13_P
LVDS14_N: R200.2 ; port RTM_LVDS_IO_ALT_12-17.LVDS14_N
LVDS14_P: R201.2 ; port RTM_LVDS_IO_ALT_12-17.LVDS14_P
LVDS15_N: R202.2 ; port RTM_LVDS_IO_ALT_12-17.LVDS15_N
LVDS15_P: R265.2 ; port RTM_LVDS_IO_ALT_12-17.LVDS15_P
LVDS16_N: R266.2 ; port RTM_LVDS_IO_ALT_12-17.LVDS16_N
LVDS16_P: R267.2 ; port RTM_LVDS_IO_ALT_12-17.LVDS16_P
LVDS17_N: R268.2 ; port RTM_LVDS_IO_ALT_12-17.LVDS17_N
LVDS17_P: R273.2 ; port RTM_LVDS_IO_ALT_12-17.LVDS17_P
LVDS18_N: R274.2 ; port RTM_LVDS_IO_ALT_18-27.LVDS18_N
LVDS18_P: R275.2 ; port RTM_LVDS_IO_ALT_18-27.LVDS18_P
LVDS19_N: R276.2 ; port RTM_LVDS_IO_ALT_18-27.LVDS19_N
LVDS19_P: R277.2 ; port RTM_LVDS_IO_ALT_18-27.LVDS19_P
LVDS20_N: R278.2 ; port RTM_LVDS_IO_ALT_18-27.LVDS20_N
LVDS20_P: R279.2 ; port RTM_LVDS_IO_ALT_18-27.LVDS20_P
LVDS21_N: R280.2 ; port RTM_LVDS_IO_ALT_18-27.LVDS21_N
LVDS21_P: R285.2 ; port RTM_LVDS_IO_ALT_18-27.LVDS21_P
LVDS22_N: R286.2 ; port RTM_LVDS_IO_ALT_18-27.LVDS22_N
LVDS22_P: R287.2 ; port RTM_LVDS_IO_ALT_18-27.LVDS22_P
LVDS23_N: R288.2 ; port RTM_LVDS_IO_ALT_18-27.LVDS23_N
LVDS23_P: R293.2 ; port RTM_LVDS_IO_ALT_18-27.LVDS23_P
LVDS24_N: R188.2 ; port RTM_LVDS_IO_ALT_18-27.LVDS24_N
LVDS24_P: R189.2 ; port RTM_LVDS_IO_ALT_18-27.LVDS24_P
LVDS25_N: R190.2 ; port RTM_LVDS_IO_ALT_18-27.LVDS25_N
LVDS25_P: R191.2 ; port RTM_LVDS_IO_ALT_18-27.LVDS25_P
LVDS26_CC_N: R194.2 ; port RTM_LVDS_IO_ALT_18-27.LVDS26_CC_N
LVDS26_CC_P: R195.2 ; port RTM_LVDS_IO_ALT_18-27.LVDS26_CC_P
LVDS27_N: R192.2 ; port RTM_LVDS_IO_ALT_18-27.LVDS27_N
LVDS27_P: R193.2 ; port RTM_LVDS_IO_ALT_18-27.LVDS27_P
LVDS28_N: J11.f4 ; port RTM_LVDS_IO.LVDS28_N
LVDS28_P: J11.e4 ; port RTM_LVDS_IO.LVDS28_P
LVDS29_N: J11.d4 ; port RTM_LVDS_IO.LVDS29_N
LVDS29_P: J11.c4 ; port RTM_LVDS_IO.LVDS29_P
LVDS30_N: J10.b5 ; port RTM_LVDS_IO.LVDS30_N
LVDS30_P: J10.a5 ; port RTM_LVDS_IO.LVDS30_P
RTM_ESD: J12.1 R12.2
RTM_FPGA_CCLK: J10.a10 ; port RTM_FPGA_CFG.RTM_FPGA_CCLK
RTM_FPGA_DIN: J10.b10 ; port RTM_FPGA_CFG.RTM_FPGA_DIN
RTM_FPGA_DONE: J10.a9 ; port RTM_FPGA_CFG.RTM_FPGA_DONE
RTM_FPGA_INIT_B: J10.b8 ; port RTM_FPGA_CFG.RTM_FPGA_INIT_B
RTM_FPGA_PROGRAM_B: J10.b9 ; port RTM_FPGA_CFG.RTM_FPGA_PROGRAM_B
RTM_SCL: J11.d2 ; port RTM_I2C.SCL
RTM_SDA: J11.d1 ; port RTM_I2C.SDA
RTM_TCK: J11.e1 ; port RTM_JTAG.TCK
RTM_TDI: J11.e2 ; port RTM_JTAG.TDI
RTM_TDO: J11.f1 ; port RTM_JTAG.TDO
RTM_TMS: J11.f2 ; port RTM_JTAG.TMS
RTM_UART_Rx: J10.b7 ; port RTM_UART.RxD
RTM_UART_Tx: J10.a7 ; port RTM_UART.TxD
NetD28_1: J11.c1 ; port RTM_PSn

Not connected (* = marked no-connect by the designer): J10 a8

### Layout directives
differential pair: GT0RX_N, GT0RX_P, GT0RXC_N, GT0RXC_P, GT0TX_N, GT0TX_P, GT1RX_N, GT1RX_P, GT1RXC_N, GT1RXC_P, GT1TX_N, GT1TX_P, GT2RX_N, GT2RX_P, GT2RXC_N, GT2RXC_P, GT2TX_N, GT2TX_P, GT3RX_N, GT3RX_P, GT3RXC_N, GT3RXC_P, GT3TX_N, GT3TX_P, GT4RX_N, GT4RX_P, GT4RXC_N, GT4RXC_P, GT4TX_N, GT4TX_P, GT5RX_N, GT5RX_P, GT5RXC_N, GT5RXC_P, GT5TX_N, GT5TX_P, GT6RX_N, GT6RX_P, GT6RXC_N, GT6RXC_P, GT6TX_N, GT6TX_P, GT7RX_N, GT7RX_P, GT7RXC_N, GT7RXC_P, GT7TX_N, GT7TX_P, GT8RX_N, GT8RX_P, GT8RXC_N, GT8RXC_P, GT8TX_N, GT8TX_P, GT9RX_N, GT9RX_P, GT9RXC_N, GT9RXC_P, GT9TX_N, GT9TX_P, GT10RX_N, GT10RX_P, GT10RXC_N, GT10RXC_P, GT10TX_N, GT10TX_P, GT11RX_N, GT11RX_P, GT11RXC_N, GT11RXC_P, GT11TX_N, GT11TX_P, GT12RX_N, GT12RX_P, GT12RXC_N, GT12RXC_P, GT12TX_N, GT12TX_P, GT13RX_N, GT13RX_P, GT13RXC_N, GT13RXC_P, GT13TX_N, GT13TX_P, GT14RX_N, GT14RX_P, GT14RXC_N, GT14RXC_P, GT14TX_N, GT14TX_P, GT15RX_N, GT15RX_P, GT15RXC_N, GT15RXC_P, GT15TX_N, GT15TX_P, GT16RX_N, GT16RX_P, GT16TX_N, GT16TX_P, GT_CLK0_IN_N, GT_CLK0_IN_P, LVDS0_CC_N, LVDS0_CC_P, LVDS1_CC_N, LVDS1_CC_P, LVDS2_N, LVDS2_P, LVDS3_N, LVDS3_P, LVDS4_N, LVDS4_P, LVDS5_N, LVDS5_P, LVDS6_N, LVDS6_P, LVDS7_N, LVDS7_P, LVDS8_N, LVDS8_P, LVDS9_N, LVDS9_P, LVDS10_N, LVDS10_P, LVDS11_N, LVDS11_P, LVDS12_N, LVDS12_P, LVDS13_N, LVDS13_P, LVDS14_N, LVDS14_P, LVDS15_N, LVDS15_P, LVDS16_N, LVDS16_P, LVDS17_N, LVDS17_P, LVDS18_N, LVDS18_P, LVDS19_N, LVDS19_P, LVDS20_N, LVDS20_P, LVDS21_N, LVDS21_P, LVDS22_N, LVDS22_P, LVDS23_N, LVDS23_P, LVDS24_N, LVDS24_P, LVDS25_N, LVDS25_P, LVDS26_CC_N, LVDS26_CC_P, LVDS27_N, LVDS27_P, LVDS28_N, LVDS28_P, LVDS29_N, LVDS29_P, LVDS30_N, LVDS30_P
net class LVDS: LVDS0_CC_N, LVDS0_CC_P, LVDS1_CC_N, LVDS1_CC_P, LVDS2_N, LVDS2_P, LVDS3_N, LVDS3_P, LVDS4_N, LVDS4_P, LVDS5_N, LVDS5_P, LVDS6_N, LVDS6_P, LVDS7_N, LVDS7_P, LVDS8_N, LVDS8_P, LVDS9_N, LVDS9_P, LVDS10_N, LVDS10_P, LVDS11_N, LVDS11_P, LVDS12_N, LVDS12_P, LVDS13_N, LVDS13_P, LVDS14_N, LVDS14_P, LVDS15_N, LVDS15_P, LVDS16_N, LVDS16_P, LVDS17_N, LVDS17_P, LVDS18_N, LVDS18_P, LVDS19_N, LVDS19_P, LVDS20_N, LVDS20_P, LVDS21_N, LVDS21_P, LVDS22_N, LVDS22_P, LVDS23_N, LVDS23_P, LVDS24_N, LVDS24_P, LVDS25_N, LVDS25_P, LVDS26_CC_N, LVDS26_CC_P, LVDS27_N, LVDS27_P, LVDS28_N, LVDS28_P, LVDS29_N, LVDS29_P, LVDS30_N, LVDS30_P
net class MGT: GT0RX_N, GT0RX_P, GT0RXC_N, GT0RXC_P, GT0TX_N, GT0TX_P, GT1RX_N, GT1RX_P, GT1RXC_N, GT1RXC_P, GT1TX_N, GT1TX_P, GT2RX_N, GT2RX_P, GT2RXC_N, GT2RXC_P, GT2TX_N, GT2TX_P, GT3RX_N, GT3RX_P, GT3RXC_N, GT3RXC_P, GT3TX_N, GT3TX_P, GT4RX_N, GT4RX_P, GT4RXC_N, GT4RXC_P, GT4TX_N, GT4TX_P, GT5RX_N, GT5RX_P, GT5RXC_N, GT5RXC_P, GT5TX_N, GT5TX_P, GT6RX_N, GT6RX_P, GT6RXC_N, GT6RXC_P, GT6TX_N, GT6TX_P, GT7RX_N, GT7RX_P, GT7RXC_N, GT7RXC_P, GT7TX_N, GT7TX_P, GT8RX_N, GT8RX_P, GT8RXC_N, GT8RXC_P, GT8TX_N, GT8TX_P, GT9RX_N, GT9RX_P, GT9RXC_N, GT9RXC_P, GT9TX_N, GT9TX_P, GT10RX_N, GT10RX_P, GT10RXC_N, GT10RXC_P, GT10TX_N, GT10TX_P, GT11RX_N, GT11RX_P, GT11RXC_N, GT11RXC_P, GT11TX_N, GT11TX_P, GT12RX_N, GT12RX_P, GT12RXC_N, GT12RXC_P, GT12TX_N, GT12TX_P, GT13RX_N, GT13RX_P, GT13RXC_N, GT13RXC_P, GT13TX_N, GT13TX_P, GT14RX_N, GT14RX_P, GT14RXC_N, GT14RXC_P, GT14TX_N, GT14TX_P, GT15RX_N, GT15RX_P, GT15RXC_N, GT15RXC_P, GT15TX_N, GT15TX_P, P3V3MP_RTM

### Notes on the sheet
- Impedance: 100Ohm diff
- Interfaces with:
- PCB_Sayma_RTM
- gigabit interfaces: CML
- other diff lines: LVDS
- control signals: 3.3V LVCMOS
- (near J11) Class D1.4 / Zone J30
- (near R188) Class D1.4
- SYNCOUT20_N
- SYNCOUT20_P
- SYNCOUT10_N
- SYNCOUT10_P
- (near J10) Class D1.4 / Zone J31
- Project/Equipment
- Document
- Designer
- Drawn by
- Check.by
- Copyright WUT ISE 2018.
  This documentation describes Open Hardware and is licensed under the CERN OHL v.1.1. You may redistribute and modify this documentation under the terms of the CERN OHL v.1.1. (http://ohwr.org/CERNOHL). This documentation is distributed WITHOUT ANY EXPRESS OR IMPLIED WARRANTY, INCLUDING OF MERCHANTABILITY, SATISFACTORY QUALITY AND FITNESS FOR A PARTICULAR PURPOSE. Please see the CERN OHL v.1.1 for applicable conditions.
- Contact
- File
- Last Mod.
- Print Date
- Sheet
- Size
- A3
- of
- Rev
- (in symbol R2010_1M_1%_0.5W_200PPM) 1%

### Library data of the parts
C160-C165 C221-C228 C233-C236 C239-C242 C245 C246 C248 C249 C252-C255 C263 C264 = CC0201_100NF_6.3V_10%_X5R: Non-polarised capacitor; Manufacturer: GENERIC; Part Description: SMD Multilayer Chip Ceramic Capacitor; Manufacturer1 Part Number: 02016D104KAT2A; Tolerance: ±10%; Voltage: 6.3V; TC: X5R; Manufacturer Part Number: CC0201_100NF_6.3V_10%_X5R; Part Number: CC0201_100NF_6.3V_10%_X5R; Value: 100nF; Component Kind: Standard; Component Type: Standard; Pin Count: 2; Status: Not Recommended; Case: 0201; Mounted: Yes; Socket: No; SMD: Yes; Sense: No; Manufacturer1 Example: AVX; Manufacturer1 ComponentHeight: 0.33mm; HelpURL: \\cern.ch\dfs\Applications\Altium\Datasheets\CC0201_X5R_AVX.pdf; Author: CERN DEM JLC; CreateDate: 03.12.2007; LatestRevisionDate: 03.12.2007
J10 J11 = TYCO_6469081-1: Connector 60 ATCA Female 30 Pairs (60 Signals) + 3x10 Ground; Manufacturer: TYCO ELECTRONICS; Part Description: 60 Positions, Pitch 2.5mm,  Advanced TCA, Z-PACK HM-Zd Right Angle Press Fit Receptacle; Part Number: TYCO_6469081-1; Component Kind: Standard; Component Type: Standard; Pin Count: 90; Family: Advanced TCA; Mounted: Yes; Socket: No; SMD: No; PressFit: Yes; Sense: No; Status: None; ComponentHeight: 12.18mm; HelpURL: \\cern.ch\dfs\Applications\Altium\Datasheets\TYCO_6469081-1.pdf; Author: CERN DEM JLC; CreateDate: 28.08.2013; LatestRevisionDate: 28.08.2013
J12 = TYCO_5120913-1: Single Pin Female; Manufacturer: TYCO ELECTRONICS; Part Description: Universal Right Angle Female Power Module Guide (keyed); PressFit: No; Manufacturer Part Number: 5120913-1; Part Number: TYCO_5120913-1; Component Kind: Standard; Component Type: Standard; Pin Count: 1; Mounted: Yes; Socket: No; SMD: No; Sense: No; Status: None; ComponentHeight: 9.78mm; HelpURL: \\cern.ch\dfs\Applications\Altium\Datasheets\TYCO_5120913-1.pdf; Author: CERN DEM JLC; CreateDate: 28.08.2013; LatestRevisionDate: 28.08.2013
R12 = R2010_1M_1%_0.5W_200PPM: Resistor - 1%; Manufacturer: GENERIC; Part Description: Thick Film Chip Resistor; Manufacturer1 Part Number: LHVC2010-1MFT4; Power: 0.5W; TC: ±200ppm/°C; PressFit: No; Manufacturer Part Number: R2010_1M_1%_0.5W_200PPM; Part Number: R2010_1M_1%_0.5W_200PPM; Tolerance: ±1%; Value: 1M; Component Kind: Standard; Component Type: Standard; Pin Count: 2; Status: None; Case: 2010; Mounted: Yes; Sense: No; Socket: No; SMD: Yes; Manufacturer1 Example: TT WELWYN; Manufacturer1 ComponentHeight: 0.65mm; HelpURL: \\cern.ch\dfs\Applications\Altium\Datasheets\R2010_WELWYN_LHVC.pdf; Author: CERN DEM JLC; CreateDate: 26.02.2015; LatestRevisionDate: 26.02.2015
R188-R202 R265-R268 R273-R280 R285-R288 R293 = R0201_0R_JUMPER: Resistor; Manufacturer: GENERIC; Manufacturer1 Part Number: CRCW02010000Z0ED; Part Description: 1A (0.05R Max DC Resistance) Zero Ohm Jumper; PressFit: No; Case: 0201; Manufacturer Part Number: R0201_0R_JUMPER; Manufacturer1 ComponentHeight: 0.27mm; Manufacturer1 Example: VISHAY; Part Number: R0201_0R_JUMPER; Pin Count: 2; Sense: No; SMD: Yes; Status: Not Recommended; Value: 0; Component Kind: Standard; Component Type: Standard; Mounted: Yes; Socket: No; HelpURL: \\cern.ch\dfs\Applications\Altium\Datasheets\R0201_VISHAY_CRCW e3.pdf; Author: CERN DEM JLC; CreateDate: 19.11.2014; LatestRevisionDate: 08.01.2015